# Altium project PCB_15122020_01CA.PrjPcb (part 2 of 7)

## Sheet RS232.SchDoc
size A3
Used 4 times, as channels USB_TO_RS232/RS232_1, USB_TO_RS232/RS232_2, USB_TO_RS232/RS232_3, USB_TO_RS232/RS232_4. Parts and nets are listed once, with the designators drawn on the sheet.
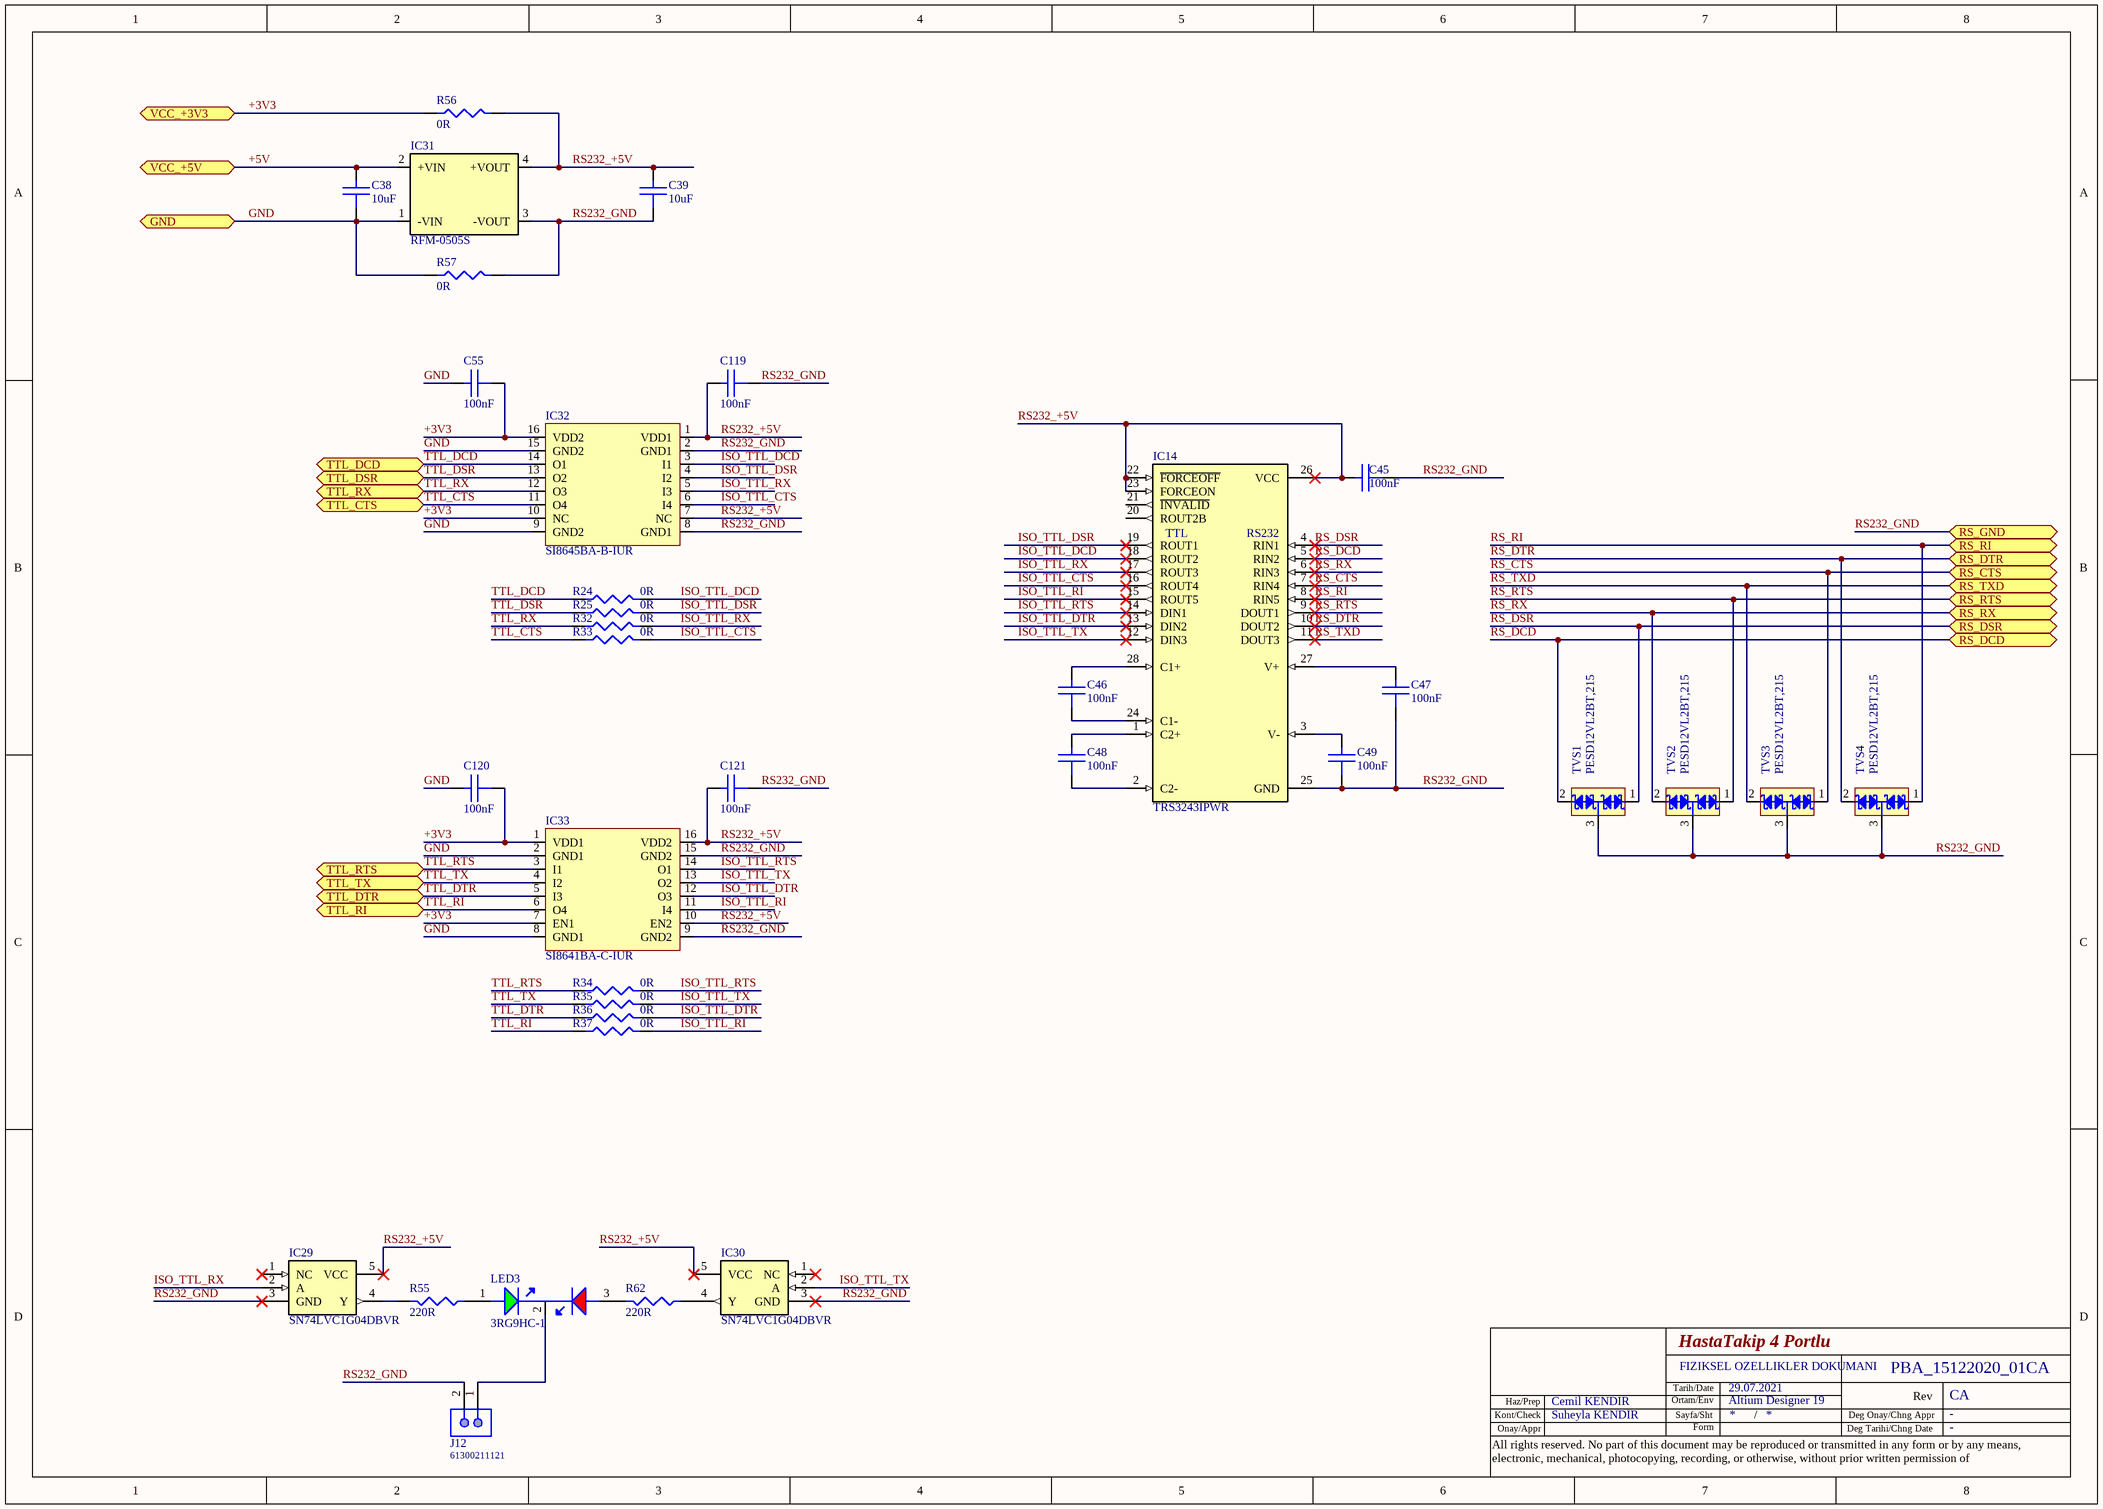
[diagram p2: RS232.SchDoc]

### Parts
C38  10uF  [C0603]
C39  10uF  [C0603]
C45  100nF  [C0603]
C46  100nF  [C0603]
C47  100nF  [C0603]
C48  100nF  [C0603]
C49  100nF  [C0603]
C55  100nF  [C0603]
C119  100nF  [C0603]
C120  100nF  [C0603]
C121  100nF  [C0603]
IC14  TRS3243IPWR  [TSSOP-28]
IC29  SN74LVC1G04DBVR  [SOT-23-5]
IC30  SN74LVC1G04DBVR  [SOT-23-5]
IC31  RFM-0505S  [RFM-0505S]
IC32  SI8645BA-B-IUR  [QSOP16]
IC33  SI8641BA-C-IUR  [QSOP16]
J12  61300211121  [61300211121]
LED3  3RG9HC-1  [3RG9HC-1]
R24  0R  [R0603]
R25  0R  [R0603]
R32  0R  [R0603]
R33  0R  [R0603]
R34  0R  [R0603]
R35  0R  [R0603]
R36  0R  [R0603]
R37  0R  [R0603]
R55  220R  [R0603]
R56  0R  [R0603]
R57  0R  [R0603]
R62  220R  [R0603]
TVS1  PESD12VL2BT,215  [SOT-23]
TVS2  PESD12VL2BT,215  [SOT-23]
TVS3  PESD12VL2BT,215  [SOT-23]
TVS4  PESD12VL2BT,215  [SOT-23]

### Ports
GND (bidir), RS_CTS (bidir), RS_DCD (bidir), RS_DSR (bidir), RS_DTR (bidir), RS_GND (bidir), RS_RI (bidir), RS_RTS (bidir), RS_RX (bidir), RS_TXD (bidir), TTL_CTS (bidir), TTL_DCD (bidir), TTL_DSR (bidir), TTL_DTR (bidir), TTL_RI (bidir), TTL_RTS (bidir), TTL_RX (bidir), TTL_TX (bidir), VCC_+3V3 (bidir), VCC_+5V (bidir)

### Nets
+3V3: C55.2 C120.2 IC32.10(NC) IC32.16(VDD2) IC33.1(VDD1) IC33.7(EN1) R56.1 ; port VCC_+3V3
+5V: C38.1 IC31.2(+VIN) ; port VCC_+5V
GND: C38.2 C55.1 C120.1 IC31.1(-VIN) IC32.9(GND2) IC32.15(GND2) IC33.2(GND1) IC33.8(GND1) R57.1 ; port GND
ISO_TTL_CTS: IC14.16(ROUT4) IC32.6(I4) R33.2
ISO_TTL_DCD: IC14.18(ROUT2) IC32.3(I1) R24.2
ISO_TTL_DSR: IC14.19(ROUT1) IC32.4(I2) R25.2
ISO_TTL_DTR: IC14.13(DIN2) IC33.12(O3) R36.2
ISO_TTL_RI: IC14.15(ROUT5) IC33.11(I4) R37.2
ISO_TTL_RTS: IC14.14(DIN1) IC33.14(O1) R34.2
ISO_TTL_RX: IC14.17(ROUT3) IC29.2(A) IC32.5(I3) R32.2
ISO_TTL_TX: IC14.12(DIN3) IC30.2(A) IC33.13(O2) R35.2
RS232_+5V: C39.1 C45.1 C119.1 C121.1 IC14.22(~{FORCEOFF}) IC14.23(FORCEON) IC14.26(VCC) IC29.5(VCC) IC30.5(VCC) IC31.4(+VOUT) IC32.1(VDD1) IC32.7(NC) IC33.10(EN2) IC33.16(VDD2) R56.2
RS232_GND: C39.2 C45.2 C47.2 C49.2 C119.2 C121.2 IC14.25(GND) IC29.3(GND) IC30.3(GND) IC31.3(-VOUT) IC32.2(GND1) IC32.8(GND1) IC33.9(GND2) IC33.15(GND2) J12.2 R57.2 TVS1.3 TVS2.3 TVS3.3 TVS4.3 ; port RS_GND
RS_CTS: IC14.7(RIN4) TVS3.1 ; port RS_CTS
RS_DCD: IC14.5(RIN2) TVS1.2 ; port RS_DCD
RS_DSR: IC14.4(RIN1) TVS1.1 ; port RS_DSR
RS_DTR: IC14.10(DOUT2) TVS4.2 ; port RS_DTR
RS_RI: IC14.8(RIN5) TVS4.1 ; port RS_RI
RS_RTS: IC14.9(DOUT1) TVS2.1 ; port RS_RTS
RS_RX: IC14.6(RIN3) TVS2.2 ; port RS_RX
RS_TXD: IC14.11(DOUT3) TVS3.2 ; port RS_TXD
TTL_CTS: IC32.11(O4) R33.1 ; port TTL_CTS
TTL_DCD: IC32.14(O1) R24.1 ; port TTL_DCD
TTL_DSR: IC32.13(O2) R25.1 ; port TTL_DSR
TTL_DTR: IC33.5(I3) R36.1 ; port TTL_DTR
TTL_RI: IC33.6(O4) R37.1 ; port TTL_RI
TTL_RTS: IC33.3(I1) R34.1 ; port TTL_RTS
TTL_RX: IC32.12(O3) R32.1 ; port TTL_RX
TTL_TX: IC33.4(I2) R35.1 ; port TTL_TX
NetC46_1: C46.1 IC14.28(C1+)
NetC46_2: C46.2 IC14.24(C1-)
NetC47_1: C47.1 IC14.27(V+)
NetC48_1: C48.1 IC14.1(C2+)
NetC48_2: C48.2 IC14.2(C2-)
NetC49_1: C49.1 IC14.3(V-)
NetIC29_4: IC29.4(Y) R55.2
NetIC30_4: IC30.4(Y) R62.1
NetJ12_1: J12.1 LED3.2
NetLED3_1: LED3.1 R55.1
NetLED3_3: LED3.3 R62.2

Not connected (* = marked no-connect by the designer): IC14 20(ROUT2B) 21(~{INVALID}); IC29 1(NC)*; IC30 1(NC)*

### Channels
USB_TO_RS232/RS232_1: designators end in _RS232_1; ports GND=GND RS_CTS=RS_CTS RS_DCD=RS_DCD RS_DSR=RS_DSR RS_DTR=RS_DTR RS_GND=RS232_GND RS_RI=RS_RI RS_RTS=RS_RTS RS_RX=RS_RX RS_TXD=RS_TXD TTL_CTS=TTL_CTS TTL_DCD=TTL_DCD TTL_DSR=TTL_DSR TTL_DTR=TTL_DTR TTL_RI=TTL_RI TTL_RTS=TTL_RTS TTL_RX=TTL_RX TTL_TX=TTL_TX VCC_+3V3=+3V3 VCC_+5V=+5V
USB_TO_RS232/RS232_2: designators end in _RS232_2; ports GND=GND RS_CTS=RS_CTS RS_DCD=RS_DCD RS_DSR=RS_DSR RS_DTR=RS_DTR RS_GND=RS232_GND RS_RI=RS_RI RS_RTS=RS_RTS RS_RX=RS_RX RS_TXD=RS_TXD TTL_CTS=TTL_CTS TTL_DCD=TTL_DCD TTL_DSR=TTL_DSR TTL_DTR=TTL_DTR TTL_RI=TTL_RI TTL_RTS=TTL_RTS TTL_RX=TTL_RX TTL_TX=TTL_TX VCC_+3V3=+3V3 VCC_+5V=+5V
USB_TO_RS232/RS232_3: designators end in _RS232_3; ports GND=GND RS_CTS=RS_CTS RS_DCD=RS_DCD RS_DSR=RS_DSR RS_DTR=RS_DTR RS_GND=RS232_GND RS_RI=RS_RI RS_RTS=RS_RTS RS_RX=RS_RX RS_TXD=RS_TXD TTL_CTS=TTL_CTS TTL_DCD=TTL_DCD TTL_DSR=TTL_DSR TTL_DTR=TTL_DTR TTL_RI=TTL_RI TTL_RTS=TTL_RTS TTL_RX=TTL_RX TTL_TX=TTL_TX VCC_+3V3=+3V3 VCC_+5V=+5V
USB_TO_RS232/RS232_4: designators end in _RS232_4; ports GND=GND RS_CTS=RS_CTS RS_DCD=RS_DCD RS_DSR=RS_DSR RS_DTR=RS_DTR RS_GND=RS232_GND RS_RI=RS_RI RS_RTS=RS_RTS RS_RX=RS_RX RS_TXD=RS_TXD TTL_CTS=TTL_CTS TTL_DCD=TTL_DCD TTL_DSR=TTL_DSR TTL_DTR=TTL_DTR TTL_RI=TTL_RI TTL_RTS=TTL_RTS TTL_RX=TTL_RX TTL_TX=TTL_TX VCC_+3V3=+3V3 VCC_+5V=+5V

### Notes on the sheet
- Tarih/Date
- Kont/Check
- Onay/Appr
- Haz/Prep
- Ortam/Env
- Sayfa/Sht
- Form
- /
- Deg Tarihi/Chng Date
- Deg Onay/Chng Appr
- Rev
- All rights reserved. No part of this document may be reproduced or transmitted in any form or by any means, electronic, mechanical, photocopying, recording, or otherwise, without prior written permission of
- (in symbol TRS3243IPWR) TTL; RS232

### Library data of the parts
C38 C39 = CC0603MRX5R6BB106: 10uF 10V X5R 20% SMD 0603 85C Paper T/R; Manufacturer: Yageo; Supplier 1: Digi-Key; Supplier Part Number 1: 311-1817-1-ND; Manufacturer Part Number: CC0603MRX5R6BB106; Stock 1: 209492; Pricing 1: 1 = 0,20000, 10 = 0,13700, 50 = 0,08200, 100 = 0,06920, 500 = 0,04736, 1000 = 0,04190 (USD); RoHS: Yes; Mount: Surface Mount; Case/Package: 0603; Case Code (Imperial): 0603; Case Code (Metric): 1608; Weight: 7.1E-05oz; Min Operating Temperature: -55°C; Max Operating Temperature: 85°C; Voltage Rating: 10V; Termination: SMD/SMT; Resistor Type: Ceramic; Dielectric: X5R; Tolerance: 20%; Packaging: Tape and Reel; Capacitance: 10uF; Voltage Rating (DC): 10V; Length: 0.063inch; Width: 0.031inch; Thickness: 0.035inch; Depth: 0.8mm; Lead Free: Lead Free; Halogen Free: Halogen Free; ComponentLink1URL: http://components.arrow.com/part/dataview/0323_03079270?src-supplier=Arrow+Europe; ComponentLink1Description: http://components.arrow.com/part/dataview/0323_03079270?src-supplier=Arrow+Europe; ComponentLink2URL: http://www.mouser.com/ds/2/447/UPY-GPHC_X5R_4V-to-50V_25-1131599.pdf?src-supplier=Mouser; ComponentLink2Description: http://www.mouser.com/ds/2/447/UPY-GPHC_X5R_4V-to-50V_25-1131599.pdf?src-supplier=Mouser; ComponentLink3URL: http://www.yageo.com/documents/recent/UPY-GPHC_X5R_4V-to-50V_25.pdf?src-supplier=Digi-Key; ComponentLink3Description: http://www.yageo.com/documents/recent/UPY-GPHC_X5R_4V-to-50V_25.pdf?src-supplier=Digi-Key; Category: Capasitor
C45-C49 C55 C119-C121 = CC0603KRX7R8BB104: 100nF, 25V, X7R, 10%, 0603; Manufacturer: Yageo; Supplier 1: Digi-Key; Supplier Part Number 1: 311-1341-1-ND; Manufacturer Part Number: CC0603KRX7R8BB104; Stock 1: 10150433; Pricing 1: 1 = 0,10000, 10 = 0,04500, 50 = 0,02480, 100 = 0,02020, 500 = 0,01444, 1000 = 0,01134 (USD); RoHS: Yes; Mount: Surface Mount; Case/Package: 0603; Number of Pins: 2; Case Code (Imperial): 0603; Case Code (Metric): 1608; Min Operating Temperature: -55°C; Max Operating Temperature: 125°C; Capacitance: 100nF; Tolerance: 10%; Voltage Rating: 25V; Packaging: Tape and Reel; Package Quantity: 1; Voltage Rating (DC): 25V; Dielectric: X7R; Termination: SMD/SMT; Resistor Type: Ceramic; Voltage: 25V; Length: 1.6mm; Width: 0.8mm; Height: 0.8mm; Thickness: 0.035inch; Depth: 0.8mm; Radiation Hardening: No; REACH SVHC: Unknown; Lead Free: Lead Free; Halogen Free: Halogen Free; ComponentLink1URL: https://datasheet.ciiva.com/11786/0900766b80c10176-11786120.pdf?src-supplier=RSComponents; ComponentLink1Description: https://datasheet.ciiva.com/11786/0900766b80c10176-11786120.pdf?src-supplier=RSComponents; ComponentLink2URL: https://datasheet.ciiva.com/144/mlccorderingcode-144075.pdf?src-supplier=Digi-Key; ComponentLink2Description: https://datasheet.ciiva.com/144/mlccorderingcode-144075.pdf?src-supplier=Digi-Key; ComponentLink3URL: https://datasheet.ciiva.com/17434/upy-gphc-x7r-6-3v-to-50v-8-17434263.pdf?src-supplier=Avnet+Europe; ComponentLink3Description: https://datasheet.ciiva.com/17434/upy-gphc-x7r-6-3v-to-50v-8-17434263.pdf?src-supplier=Avnet+Europe; ComponentLink4URL: https://datasheet.ciiva.com/26829/getdatasheetpartid-403577-26829431.pdf?src-supplier=Verical; ComponentLink4Description: https://datasheet.ciiva.com/26829/getdatasheetpartid-403577-26829431.pdf?src-supplier=Verical; ComponentLink5URL: https://datasheet.ciiva.com/11587/upy-gphc-x7r-6-3v-to-50v-8-11587208.pdf?src-supplier=Avnet; ComponentLink5Description: https://datasheet.ciiva.com/11587/upy-gphc-x7r-6-3v-to-50v-8-11587208.pdf?src-supplier=Avnet; ComponentLink6URL: https://datasheet.ciiva.com/13389/upy-gphc-x7r-6-3v-to-50v-8-13389352.pdf?src-supplier=Mouser; ComponentLink6Description: https://datasheet.ciiva.com/13389/upy-gphc-x7r-6-3v-to-50v-8-13389352.pdf?src-supplier=Mouser; ComponentLink7URL: https://datasheet.ciiva.com/28450/1489800-28450584.pdf?src-supplier=Element14; ComponentLink7Description: https://datasheet.ciiva.com/28450/1489800-28450584.pdf?src-supplier=Element14; ComponentLink8URL: https://datasheet.ciiva.com/144/mlccorderingcode-144073.pdf?src-supplier=Digi-Key; ComponentLink8Description: https://datasheet.ciiva.com/144/mlccorderingcode-144073.pdf?src-supplier=Digi-Key; ComponentLink9URL: https://datasheet.ciiva.com/144/mlccorderingcode-144074.pdf?src-supplier=Digi-Key; ComponentLink9Description: https://datasheet.ciiva.com/144/mlccorderingcode-144074.pdf?src-supplier=Digi-Key; ComponentLink10URL: https://datasheet.ciiva.com/7978/1489800-7978155.pdf?src-supplier=Element14; ComponentLink10Description: https://datasheet.ciiva.com/7978/1489800-7978155.pdf?src-supplier=Element14; Category: Capasitor
IC14 = TRS3243IPWR: 3-V to 5.5-V Multichannel RS-232 Line Driver/Receiver With +/-15-kV (HBM) ESD Protection 28-TSSOP -40 to 85; Manufacturer: Texas Instruments; Data Rate: 250Kbps; Number of Receivers: 5; Number of Transmitters: 3; Max Supply Voltage: 5.5V; Min Supply Voltage: 3V; Nominal Supply Current: 1mA; Number of Transceivers: 1; Operating Supply Voltage: 5V; Supplier 1: Mouser; Supplier Part Number 1: 595-TRS3243IPWR; Manufacturer Part Number: TRS3243IPWR; Stock 1: 2373; Pricing 1: 1 = 1,72000, 10 = 1,46000, 100 = 1,17000, 250 = 1,03000, 500 = 0,99100, 1000 = 0,78700 (USD); Mount: Surface Mount; Case/Package: TSSOP; Number of Pins: 28; Weight: 0.004145oz; Min Operating Temperature: -40°C; Max Operating Temperature: 85°C; Package Quantity: 1; Packaging: Tape and Reel; Number of Drivers: 3; Logic Function: Receiver; Radiation Hardening: No; Lead Free: Lead Free; ComponentLink1URL: https://datasheet.ciiva.com/26913/getdatasheetpartid-247119-26913223.pdf?src-supplier=Verical; ComponentLink1Description: https://datasheet.ciiva.com/26913/getdatasheetpartid-247119-26913223.pdf?src-supplier=Verical; ComponentLink2URL: https://datasheet.ciiva.com/1705/trs3243-1705475.pdf?src-supplier=Digi-Key; ComponentLink2Description: https://datasheet.ciiva.com/1705/trs3243-1705475.pdf?src-supplier=Digi-Key; ComponentLink3URL: https://datasheet.ciiva.com/1705/trs3243-1705476.pdf?src-supplier=Digi-Key; ComponentLink3Description: https://datasheet.ciiva.com/1705/trs3243-1705476.pdf?src-supplier=Digi-Key; ComponentLink4URL: https://datasheet.ciiva.com/1705/trs3243-1705477.pdf?src-supplier=Digi-Key; ComponentLink4Description: https://datasheet.ciiva.com/1705/trs3243-1705477.pdf?src-supplier=Digi-Key; ComponentLink5URL: https://octopart.com/click/track?ai=10049&ct=datasheets&sig=01ed8e4&at=physicalpart&sid=370&ppid=7097462&hlid=30260159&src-supplier=TI+store; ComponentLink5Description: https://octopart.com/click/track?ai=10049&ct=datasheets&sig=01ed8e4&at=physicalpart&sid=370&ppid=7097462&hlid=30260159&src-supplier=TI+store; ComponentLink6URL: http://datasheet.octopart.com/TRS3243IPWR-Texas-Instruments-datasheet-149751.pdf?src-supplier=TI+store; ComponentLink6Description: http://datasheet.octopart.com/TRS3243IPWR-Texas-Instruments-datasheet-149751.pdf?src-supplier=TI+store; ComponentLink7URL: http://datasheet.octopart.com/TRS3243IPWR-Texas-Instruments-datasheet-10256493.pdf?src-supplier=TI+store; ComponentLink7Description: http://datasheet.octopart.com/TRS3243IPWR-Texas-Instruments-datasheet-10256493.pdf?src-supplier=TI+store; ComponentLink8URL: http://datasheet.octopart.com/TRS3243IPWR-Texas-Instruments-datasheet-41218929.pdf?src-supplier=TI+store; ComponentLink8Description: http://datasheet.octopart.com/TRS3243IPWR-Texas-Instruments-datasheet-41218929.pdf?src-supplier=TI+store; ComponentLink9URL: http://sigma.octopart.com/49249796/technical_drawing/Texas-Instruments-TRS3243IPWR.pdf?src-supplier=TI+store; ComponentLink9Description: http://sigma.octopart.com/49249796/technical_drawing/Texas-Instruments-TRS3243IPWR.pdf?src-supplier=TI+store; Category: Integrated Circuits-Interface - Drivers, Receivers, Transceivers
IC29 IC30 = SN74LVC1G04DBVR: Inverter 1-Element CMOS 5-Pin SOT-23 T/R; Manufacturer: Texas Instruments; Number of Inputs: 1; Propagation Delay: 3.7ns; Output Current: 32mA; Min Supply Voltage: 1.65V; Max Supply Voltage: 5.5V; Logic Function: Inverter,Inverting,Buffer; Quiescent Current: 10uA; High Level Output Current: -32mA; Turn-On Delay Time: 7.5ns; Schmitt Trigger Input: No; Supplier 1: Digi-Key; Manufacturer Part Number: SN74LVC1G04DBVR; Stock 1: 132873; Pricing 1: 1 = 0,30000, 10 = 0,24700, 25 = 0,20720, 100 = 0,13110, 250 = 0,10120, 500 = 0,08624, 1000 = 0,05865 (USD); RoHS: Yes; Mount: Surface Mount; Case/Package: SOT-23; Number of Pins: 5; Weight: 0.000557oz; Contact Plating: Tin,Matte; Min Operating Temperature: -40°C; Max Operating Temperature: 125°C; Packaging: Tape and Reel; Max Output Current: 32mA; Number of Elements: 1; Package Quantity: 1; Number of Circuits: 1; Low Level Output Current: 32mA; Termination: SMD/SMT; Number of Gates: 1; Number of Bits: 1; Length: 3.05mm; Width: 1.75mm; Height: 1.3mm; Radiation Hardening: No; REACH SVHC: No SVHC; Lead Free: Lead Free; RoHS Compliant: Yes; ComponentLink1URL: https://datasheet.ciiva.com/1864/sn74lvc1g04-1864160.pdf?src-supplier=Digi-Key; ComponentLink1Description: https://datasheet.ciiva.com/1864/sn74lvc1g04-1864160.pdf?src-supplier=Digi-Key; ComponentLink2URL: https://datasheet.ciiva.com/7783/1700972-7783424.pdf?src-supplier=Element14; ComponentLink2Description: https://datasheet.ciiva.com/7783/1700972-7783424.pdf?src-supplier=Element14; ComponentLink3URL: https://datasheet.ciiva.com/36526/2014932-36526251.pdf?src-supplier=Jameco; ComponentLink3Description: https://datasheet.ciiva.com/36526/2014932-36526251.pdf?src-supplier=Jameco; ComponentLink4URL: https://datasheet.ciiva.com/14290/sn74lvc1g04-14290295.pdf?src-supplier=Avnet; ComponentLink4Description: https://datasheet.ciiva.com/14290/sn74lvc1g04-14290295.pdf?src-supplier=Avnet; ComponentLink5URL: https://datasheet.ciiva.com/1864/sn74lvc1g04-1864158.pdf?src-supplier=Digi-Key; ComponentLink5Description: https://datasheet.ciiva.com/1864/sn74lvc1g04-1864158.pdf?src-supplier=Digi-Key; Category: Integrated Circuits (ICs); Supplier Part Number 1: 296-11599-1-ND
IC31 = RFM-0505S: RECOM POWER - RFM-0505S - Isolated Board Mount DC/DC Converter, ITE & General, 1 Output, 1 W, 5 V, 200 mA; Max Output Voltage: 5V; Supplier 1: Digi-Key; Manufacturer: Recom; Manufacturer Part Number: RFM-0505S; Stock 1: 13682; Pricing 1: 1 = 1,40000, 5 = 1,38000, 10 = 1,36000, 25 = 1,32000, 50 = 1,28000, 100 = 1,24000, 250 = 1,20000, 500 = 1,12000 (USD); RoHS: No; Weight: 1.4g; Length: 11.5mm; Height: 10mm; Width: 6mm; ComponentLink1URL: http://www.farnell.com/datasheets/2787866.pdf?src-supplier=Farnell; ComponentLink1Description: http://www.farnell.com/datasheets/2787866.pdf?src-supplier=Farnell; ComponentLink2URL: https://www.recom-power.com/pdf/Econoline/RFM.pdf?src-supplier=Digi-Key; ComponentLink2Description: https://www.recom-power.com/pdf/Econoline/RFM.pdf?src-supplier=Digi-Key; ComponentLink3URL: http://www.farnell.com/datasheets/2787866.pdf?src-supplier=Newark; ComponentLink3Description: http://www.farnell.com/datasheets/2787866.pdf?src-supplier=Newark; Supplier Part Number 1: 945-3159-ND; Category: Power Supplies - Board Mount DC-DC Converters
IC32 = SI8645BA-B-IUR: Digital Isolator CMOS 4-CH 150Mbps Automotive 16-Pin QSOP T/R; Manufacturer: Silicon Labs; Number of Channels: 4; Propagation Delay: 13ns; Channel Type: Unidirectional; Isolated Power: No; Pulse Width Distortion (PWD): 4.5ns; Supplier 1: Digi-Key; Manufacturer Part Number: SI8645BA-B-IUR; Stock 1: 4650; Pricing 1: 1 = 1,64000, 25 = 1,57480, 100 = 1,55400 (USD); RoHS: Yes; Case/Package: QSOP; Number of Pins: 16; Weight: 0.002931oz; Min Operating Temperature: -40°C; Max Operating Temperature: 125°C; Package Quantity: 2500; Packaging: Tape and Reel; Data Rate: 150Mbps; Type: General Purpose; Series: Si8645BA; RoHS Compliant: Yes; ComponentLink1URL: https://datasheet.ciiva.com/15272/si864x-15272845.pdf?src-supplier=Arrow+Europe; ComponentLink1Description: https://datasheet.ciiva.com/15272/si864x-15272845.pdf?src-supplier=Arrow+Europe; ComponentLink2URL: https://datasheet.ciiva.com/8124/si864x-8124729.pdf?src-supplier=Avnet; ComponentLink2Description: https://datasheet.ciiva.com/8124/si864x-8124729.pdf?src-supplier=Avnet; Supplier Part Number 1: SI8645BA-B-IURCT-ND; Category: Isolators
IC33 = SI8641BA-C-IUR: General Purpose tal Isolator 1000Vrms 4 Channel 150Mbps 35kV/µs CMTI 16-SSOP (0.154 , 3.90mm Width); Manufacturer: Silicon Labs; Number of Channels: 4; Channel Type: Unidirectional; Propagation Delay: 13ns; Isolated Power: No; Pulse Width Distortion (PWD): 4.5ns; Supplier 1: Digi-Key; Manufacturer Part Number: SI8641BA-C-IUR; Stock 1: 611; Pricing 1: 1 = 1,64000, 25 = 1,57480, 100 = 1,55400 (USD); RoHS: Yes; Case/Package: SSOP; Number of Pins: 16; Min Operating Temperature: -40°C; Max Operating Temperature: 125°C; Type: General Purpose; Packaging: Tape and Reel; Data Rate: 150Mbps; ComponentLink1URL: https://datasheet.ciiva.com/48508/si864x-48508591.pdf?src-supplier=Avnet; ComponentLink1Description: https://datasheet.ciiva.com/48508/si864x-48508591.pdf?src-supplier=Avnet; Supplier Part Number 1: 336-4939-1-ND; Category: Isolators
J12 = 61300211121: WR-PHD Pin Header, THT, pitch 2.54mm, Single Row, Vertical, 2pin; Manufacturer: Wurth Electronics; Pin Number: 2; Gender: Male; Rated Current: 3A; Working Voltage: 250VAC; Withstanding Voltage: 500VAC; Contact Resistance: 20mOhm; Voltage Rating: 250V; Connector Type: Male Pin; ComponentLink1Description: Manufacturer; ComponentLink1URL: http://www.we-online.de; ComponentLink2Description: Datasheet; ComponentLink2URL: https://katalog.we-online.de/em/datasheet/6130xx11121.pdf; Part Number: 61300211121; Published Date: June 2019; Publisher: Wurth Elektronik; Pitch: 2.54mm; Operating Temperature: -40 to +105degC; Mounting Technology: THT; Packaging: Bag; Row Number: Single; Orientation: Vertical; Supplier 1: Digi-Key; Manufacturer Part Number: 61300211121; Stock 1: 150487; Pricing 1: 1 = 0,13000, 10 = 0,10600, 25 = 0,08800, 50 = 0,07400, 100 = 0,06700, 1000 = 0,06100 (USD); RoHS: Yes; Mount: Through Hole; Contact Plating: Gold; Housing Material: PBT; Contact Material: Copper Alloy,Copper; Color: Black; Min Operating Temperature: -40°C; Max Operating Temperature: 125°C; Number of Rows: 1; Contact Gender: Male; Current Rating: 3A; Number of Positions: 2; Termination: Through Hole; Number of Contacts: 2; Contact Mating Length: 0.236inch; REACH SVHC: Unknown; Lead Free: Lead Free; ComponentLink3URL: https://datasheet.ciiva.com/13619/6130xx11121-48870-13619345.pdf?src-supplier=Mouser; ComponentLink3Description: https://datasheet.ciiva.com/13619/6130xx11121-48870-13619345.pdf?src-supplier=Mouser; Category: Connectors, Interconnects Rectangular Connectors; Supplier Part Number 1: 732-5315-ND
LED3 = 3RG9HC-1: LED 3MM RED, GREEN R:30mcd, G:60mcd 40°; Manufacturer: STRONG BASE; Category: Led; Supplier 1: Özdisan; Supplier Part Number 1: 3RG9HC-1
R24 R25 R32-R37 R56 R57 = RC0603FR-070RL: 0R ,%1 ,1/10 W ,0603; Manufacturer: Yageo; Resistance: 0mR; Power Rating: 100mW; Tolerance: 1%; Voltage Rating: 50V; Temperature Coefficient: 200ppm/°C; Current Rating: 1A; Working Voltage: 75V; Supplier 1: Digi-Key; Supplier Part Number 1: 311-0.0HRCT-ND; Manufacturer Part Number: RC0603FR-070RL; Stock 1: 513794; Pricing 1: 1 = 0,10000, 10 = 0,01800, 25 = 0,01280, 50 = 0,00980, 100 = 0,00730, 250 = 0,00552, 500 = 0,00442, 1000 = 0,00326 (USD); RoHS: Yes; Case/Package: 0603; Number of Pins: 2; Case Code (Metric): 1608; Case Code (Imperial): 0603; Contact Plating: Tin,Matte; Min Operating Temperature: -55°C; Max Operating Temperature: 155°C; Packaging: Tape and Reel; Package Quantity: 5000; Resistor Type: Thick Film; Number of Terminations: 2; Termination: SMD/SMT; Max Power Dissipation: 100mW; Voltage Rating (DC): 50V; Features: Moisture Resistant; Length: 1.6mm; Width: 0.031inch; Height: 0.45mm; Depth: 0.8mm; Radiation Hardening: No; REACH SVHC: No SVHC; Military Standard: Not; Lead Free: Lead Free; ComponentLink1URL: https://datasheet.ciiva.com/11808/0900766b80f96399-11808172.pdf?src-supplier=RSComponents; ComponentLink1Description: https://datasheet.ciiva.com/11808/0900766b80f96399-11808172.pdf?src-supplier=RSComponents; ComponentLink2URL: https://datasheet.ciiva.com/5558/rc0603-272842-5558341.pdf?src-supplier=Mouser; ComponentLink2Description: https://datasheet.ciiva.com/5558/rc0603-272842-5558341.pdf?src-supplier=Mouser; ComponentLink3URL: https://datasheet.ciiva.com/46382/443971-46382072.pdf?src-supplier=Element14; ComponentLink3Description: https://datasheet.ciiva.com/46382/443971-46382072.pdf?src-supplier=Element14; ComponentLink4URL: https://datasheet.ciiva.com/29721/pyu-r-int-thick-7-29721178.pdf?src-supplier=Digi-Key; ComponentLink4Description: https://datasheet.ciiva.com/29721/pyu-r-int-thick-7-29721178.pdf?src-supplier=Digi-Key; ComponentLink5URL: https://datasheet.ciiva.com/5684/443971-5684699.pdf?src-supplier=Farnell; ComponentLink5Description: https://datasheet.ciiva.com/5684/443971-5684699.pdf?src-supplier=Farnell; ComponentLink6URL: https://datasheet.ciiva.com/7983/443971-7983627.pdf?src-supplier=Element14; ComponentLink6Description: https://datasheet.ciiva.com/7983/443971-7983627.pdf?src-supplier=Element14; ComponentLink7URL: https://datasheet.ciiva.com/29721/pyu-rc0603-51-rohs-l-4-29721179.pdf?src-supplier=Digi-Key; ComponentLink7Description: https://datasheet.ciiva.com/29721/pyu-rc0603-51-rohs-l-4-29721179.pdf?src-supplier=Digi-Key; ComponentLink8URL: https://datasheet.ciiva.com/22643/1868787-22643388.pdf?src-supplier=Element14; ComponentLink8Description: https://datasheet.ciiva.com/22643/1868787-22643388.pdf?src-supplier=Element14; Category: Resistor
R55 R62 = RC0603FR-07220RL: 220 R, %1, 1/10W, 0603; Manufacturer: Yageo; Tolerance: 1%; Voltage Rating (DC): 50V; Temperature Coefficient: 100ppm/°C; Power Rating: 100mW; Supplier 1: Digi-Key; Supplier Part Number 1: 311-220HRCT-ND; Manufacturer Part Number: RC0603FR-07220RL; Stock 1: 3174401; Pricing 1: 1 = 0,10000, 10 = 0,02100, 100 = 0,00840, 1000 = 0,00379, 2500 = 0,00329 (USD); RoHS: Yes; Case/Package: 0603; Number of Pins: 2; Case Code (Imperial): 0603; Case Code (Metric): 1608; Min Operating Temperature: -55°C; Max Operating Temperature: 155°C; Resistance: 220R; Packaging: Tape and Reel; Resistor Type: Thick Film; Voltage Rating: 50V; Package Quantity: 1; Termination: SMD/SMT; Number of Terminations: 2; Max Power Dissipation: 100mW; Features: Moisture Resistant; Length: 1.6mm; Width: 0.031inch; Height: 0.022inch; Depth: 0.8mm; REACH SVHC: No SVHC; Lead Free: Lead Free; Military Standard: Not; ComponentLink1URL: https://datasheet.ciiva.com/2453/pyu-r-int-thick-7-2453973.pdf?src-supplier=Digi-Key; ComponentLink1Description: https://datasheet.ciiva.com/2453/pyu-r-int-thick-7-2453973.pdf?src-supplier=Digi-Key; ComponentLink2URL: https://datasheet.ciiva.com/2453/pyu-r-int-thick-7-2453974.pdf?src-supplier=Digi-Key; ComponentLink2Description: https://datasheet.ciiva.com/2453/pyu-r-int-thick-7-2453974.pdf?src-supplier=Digi-Key; ComponentLink3URL: https://datasheet.ciiva.com/2453/pyu-r-int-thick-7-2453975.pdf?src-supplier=Digi-Key; ComponentLink3Description: https://datasheet.ciiva.com/2453/pyu-r-int-thick-7-2453975.pdf?src-supplier=Digi-Key; ComponentLink4URL: https://datasheet.ciiva.com/7746/1738695-7746300.pdf?src-supplier=Element14; ComponentLink4Description: https://datasheet.ciiva.com/7746/1738695-7746300.pdf?src-supplier=Element14; ComponentLink5URL: https://datasheet.ciiva.com/7746/1738695-7746301.pdf?src-supplier=Element14; ComponentLink5Description: https://datasheet.ciiva.com/7746/1738695-7746301.pdf?src-supplier=Element14; Category: Resistor
TVS1-TVS4 = PESD12VL2BT,215: TVS DIODE 12V 37V SOT23; Manufacturer: Nexperia; Supplier 1: Digi-Key; Manufacturer Part Number: PESD12VL2BT,215; Stock 1: 13763; Pricing 1: 1 = 0,44000, 10 = 0,35700, 100 = 0,24320, 500 = 0,18240, 1000 = 0,13680 (USD); RoHS: Yes; RoHS Compliant: Yes; ComponentLink1URL: http://www.farnell.com/datasheets/698115.pdf?src-supplier=Farnell; ComponentLink1Description: http://www.farnell.com/datasheets/698115.pdf?src-supplier=Farnell; ComponentLink2URL: https://assets.nexperia.com/documents/data-sheet/PESDXL2BT_SER.pdf?src-supplier=Digi-Key; ComponentLink2Description: https://assets.nexperia.com/documents/data-sheet/PESDXL2BT_SER.pdf?src-supplier=Digi-Key; ComponentLink3URL: http://www.farnell.com/datasheets/698115.pdf?src-supplier=Newark; ComponentLink3Description: http://www.farnell.com/datasheets/698115.pdf?src-supplier=Newark; Supplier Part Number 1: 1727-3809-1-ND; Category: Circuit Protection - TVS - Diodes

## Sheet USB_Hub.SchDoc
size A3
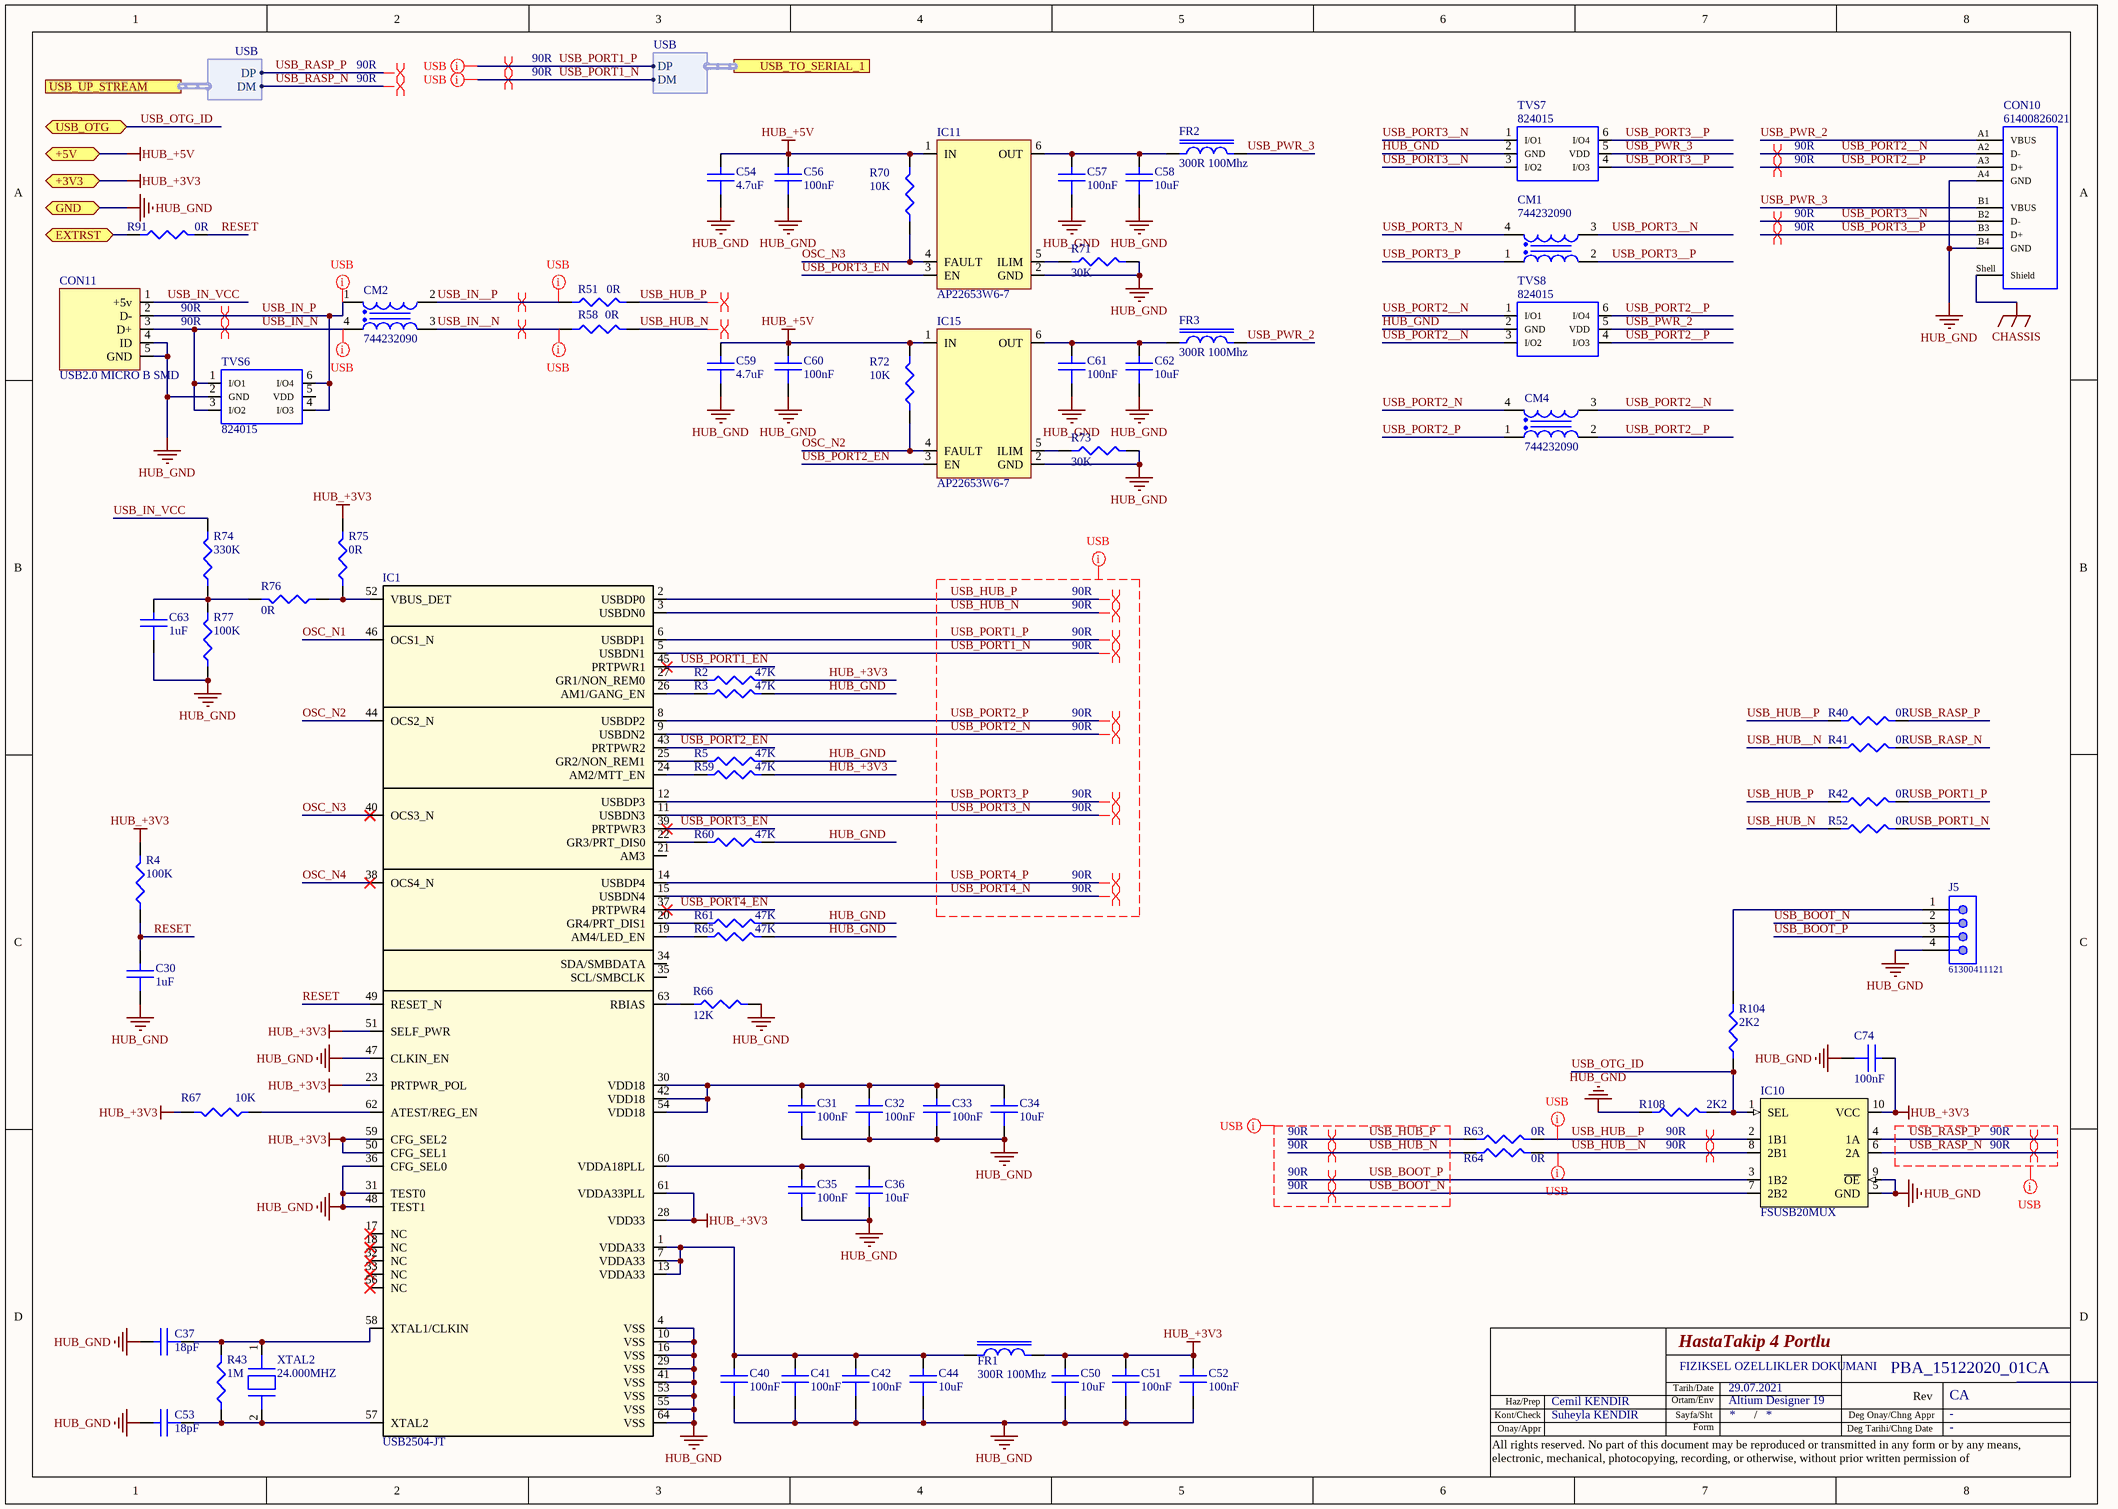
[diagram p3: USB_Hub.SchDoc]

### Parts
C30  1uF  [C0603]
C31  100nF  [C0603]
C32  100nF  [C0603]
C33  100nF  [C0603]
C34  10uF  [C0603]
C35  100nF  [C0603]
C36  10uF  [C0603]
C37  18pF  [C0603]
C40  100nF  [C0603]
C41  100nF  [C0603]
C42  100nF  [C0603]
C44  10uF  [C0603]
C50  10uF  [C0603]
C51  100nF  [C0603]
C52  100nF  [C0603]
C53  18pF  [C0603]
C54  4.7uF  [C0603]
C56  100nF  [C0603]
C57  100nF  [C0603]
C58  10uF  [C0603]
C59  4.7uF  [C0603]
C60  100nF  [C0603]
C61  100nF  [C0603]
C62  10uF  [C0603]
C63  1uF  [C0603]
C74  100nF  [C0603]
CM1  744232090  [WE-CNSW_1206]
CM2  744232090  [WE-CNSW_1206]
CM4  744232090  [WE-CNSW_1206]
CON10  61400826021  [61400826021]
CON11  USB2.0 MICRO B SMD  [USB CON B FEMALE]
FR1  300R 100Mhz  [WE-CBF_0603_High Current]
FR2  300R 100Mhz  [WE-CBF_0603_High Current]
FR3  300R 100Mhz  [WE-CBF_0603_High Current]
IC1  USB2504-JT  [TQFP64]
IC10  FSUSB20MUX  [MSOP-10N]
IC11  AP22653W6-7  [SOT23-6]
IC15  AP22653W6-7  [SOT23-6]
J5  61300411121  [61300411121]
R2  47K  [R0603]
R3  47K  [R0603]
R4  100K  [R0603]
R5  47K  [R0603]
R40  0R  [R0402]
R41  0R  [R0402]
R42  0R  [R0402]
R43  1M  [R0603]
R51  0R  [R0402]
R52  0R  [R0402]
R58  0R  [R0402]
R59  47K  [R0603]
R60  47K  [R0603]
R61  47K  [R0603]
R63  0R  [R0402]
R64  0R  [R0402]
R65  47K  [R0603]
R66  12K  [R0603]
R67  10K  [R0603]
R70  10K  [R0603]
R71  30K  [R0603]
R72  10K  [R0603]
R73  30K  [R0603]
R74  330K  [R0603]
R75  0R  [R0603]
R76  0R  [R0603]
R77  100K  [R0603]
R91  0R  [R0603]
R104  2K2  [R0603]
R108  2K2  [R0603]
TVS6  824015  [SOT-23-6]
TVS7  824015  [SOT-23-6]
TVS8  824015  [SOT-23-6]
XTAL2  24.000MHZ  [CrystalSMD]

### Ports
+3V3 (bidir), +5V (bidir), EXTRST (bidir), GND (bidir), USB_OTG (bidir), USB_TO_SERIAL_1 (harness USB), USB_UP_STREAM (harness USB)

### Harnesses
USB: DP, DM

### Nets
CHASSIS: CON10.Shell(Shield)
HUB_+3V3: C50.1 C51.1 C52.1 C74.1 FR1.2 IC1.23(PRTPWR_POL) IC1.28(VDD33) IC1.50(CFG_SEL1) IC1.51(SELF_PWR) IC1.59(CFG_SEL2) IC1.61(VDDA33PLL) IC10.10(VCC) R2.2 R4.2 R59.2 R67.2 R75.2 ; port +3V3  [project net +3V3]
HUB_+5V: C54.1 C56.1 C59.1 C60.1 IC11.1(IN) IC15.1(IN) R70.2 R72.2 ; port +5V  [project net +5V]
HUB_GND: C30.2 C31.2 C32.2 C33.2 C34.2 C35.2 C36.2 C37.1 C40.2 C41.2 C42.2 C44.2 C50.2 C51.2 C52.2 C53.1 C54.2 C56.2 C57.2 C58.2 C59.2 C60.2 C61.2 C62.2 C63.2 C74.2 CON10.A4(GND) CON10.B4(GND) CON11.4(ID) CON11.5(GND) IC1.4(VSS) IC1.10(VSS) IC1.16(VSS) IC1.29(VSS) IC1.31(TEST0) IC1.36(CFG_SEL0) IC1.41(VSS) IC1.47(CLKIN_EN) IC1.48(TEST1) IC1.53(VSS) IC1.55(VSS) IC1.64(VSS) IC10.5(GND) IC10.9(~{OE}) IC11.2(GND) IC15.2(GND) J5.4 R3.2 R5.2 R60.2 R61.2 R65.2 R66.2 R71.2 R73.2 R77.1 R108.1 TVS6.2(GND) TVS7.2(GND) TVS8.2(GND) ; port GND  [project net GND]
nEXTRST: R91.1 ; port EXTRST
OSC_N1: IC1.46(OCS1_N)
OSC_N2: IC1.44(OCS2_N) IC15.4(FAULT) R72.1
OSC_N3: IC1.40(OCS3_N) IC11.4(FAULT) R70.1
OSC_N4: IC1.38(OCS4_N)
RESET: C30.1 IC1.49(RESET_N) R4.1 R91.2
USB_BOOT_N: IC10.7(2B2) J5.2
USB_BOOT_P: IC10.3(1B2) J5.3
USB_HUB__N: IC10.8(2B1) R41.1 R64.2
USB_HUB__P: IC10.2(1B1) R40.1 R63.2
USB_HUB_N: IC1.3(USBDN0) R52.1 R58.2 R64.1
USB_HUB_P: IC1.2(USBDP0) R42.1 R51.2 R63.1
USB_IN__N: CM2.3 R58.1
USB_IN__P: CM2.2 R51.1
USB_IN_N: CM2.4 CON11.3(D+) TVS6.1(I/O1) TVS6.3(I/O2)
USB_IN_P: CM2.1 CON11.2(D-) TVS6.4(I/O3) TVS6.6(I/O4)
USB_IN_VCC: CON11.1(+5v) R74.2
USB_OTG_ID: IC10.1(SEL) R104.1 R108.2 ; port USB_OTG
USB_PORT1_EN: IC1.45(PRTPWR1)
USB_PORT1_N: IC1.5(USBDN1) R52.2 ; port USB_TO_SERIAL_1.DM  [project net USB_1_N]
USB_PORT1_P: IC1.6(USBDP1) R42.2 ; port USB_TO_SERIAL_1.DP  [project net USB_1_P]
USB_PORT2__N: CM4.3 CON10.A2(D-) TVS8.1(I/O1) TVS8.3(I/O2)
USB_PORT2__P: CM4.2 CON10.A3(D+) TVS8.4(I/O3) TVS8.6(I/O4)
USB_PORT2_EN: IC1.43(PRTPWR2) IC15.3(EN)
USB_PORT2_N: CM4.4 IC1.9(USBDN2)
USB_PORT2_P: CM4.1 IC1.8(USBDP2)
USB_PORT3__N: CM1.3 CON10.B2(D-) TVS7.1(I/O1) TVS7.3(I/O2)
USB_PORT3__P: CM1.2 CON10.B3(D+) TVS7.4(I/O3) TVS7.6(I/O4)
USB_PORT3_EN: IC1.39(PRTPWR3) IC11.3(EN)
USB_PORT3_N: CM1.4 IC1.11(USBDN3)
USB_PORT3_P: CM1.1 IC1.12(USBDP3)
USB_PORT4_EN: IC1.37(PRTPWR4)
USB_PORT4_N: IC1.15(USBDN4)
USB_PORT4_P: IC1.14(USBDP4)
USB_PWR_2: CON10.A1(VBUS) FR3.2 TVS8.5(VDD)
USB_PWR_3: CON10.B1(VBUS) FR2.2 TVS7.5(VDD)
USB_RASP_N: IC10.6(2A) R41.2 ; port USB_UP_STREAM.DM  [project net USB_N]
USB_RASP_P: IC10.4(1A) R40.2 ; port USB_UP_STREAM.DP  [project net USB_P]
NetC31_1: C31.1 C32.1 C33.1 C34.1 IC1.30(VDD18) IC1.42(VDD18) IC1.54(VDD18)
NetC35_1: C35.1 C36.1 IC1.60(VDDA18PLL)
NetC37_2: C37.2 IC1.58(XTAL1/CLKIN) R43.2 XTAL2.1
NetC40_1: C40.1 C41.1 C42.1 C44.1 FR1.1 IC1.1(VDDA33) IC1.7(VDDA33) IC1.13(VDDA33)
NetC53_2: C53.2 IC1.57(XTAL2) R43.1 XTAL2.2
NetC57_1: C57.1 C58.1 FR2.1 IC11.6(OUT)
NetC61_1: C61.1 C62.1 FR3.1 IC15.6(OUT)
NetC63_1: C63.1 R74.1 R76.2 R77.2
NetIC1_19: IC1.19(AM4/LED_EN) R65.1
NetIC1_20: IC1.20(GR4/PRT_DIS1) R61.1
NetIC1_22: IC1.22(GR3/PRT_DIS0) R60.1
NetIC1_24: IC1.24(AM2/MTT_EN) R59.1
NetIC1_25: IC1.25(GR2/NON_REM1) R5.1
NetIC1_26: IC1.26(AM1/GANG_EN) R3.1
NetIC1_27: IC1.27(GR1/NON_REM0) R2.1
NetIC1_52: IC1.52(VBUS_DET) R75.1 R76.1
NetIC1_62: IC1.62(ATEST/REG_EN) R67.1
NetIC1_63: IC1.63(RBIAS) R66.1
NetIC11_5: IC11.5(ILIM) R71.1
NetIC15_5: IC15.5(ILIM) R73.1
NetJ5_1: J5.1 R104.2

Not connected (* = marked no-connect by the designer): IC1 17(NC)* 18(NC)* 21(AM3) 32(NC)* 33(NC)* 34(SDA/SMBDATA) 35(SCL/SMBCLK) 56(NC)*; TVS6 5(VDD)

### Layout directives
differential pair; differential pair class 90R: USB_1_N, USB_1_P, USB_BOOT_N, USB_BOOT_P, USB_HUB__N, USB_HUB__P, USB_HUB_N, USB_HUB_P, USB_IN__N, USB_IN__P, USB_IN_N, USB_IN_P, USB_N, USB_P, USB_PORT2__N, USB_PORT2__P, USB_PORT2_N, USB_PORT2_P, USB_PORT3__N, USB_PORT3__P, USB_PORT3_N, USB_PORT3_P, USB_PORT4_N, USB_PORT4_P
net class USB: USB_1_N, USB_1_P, USB_BOOT_N, USB_BOOT_P, USB_HUB__N, USB_HUB__P, USB_HUB_N, USB_HUB_P, USB_IN__N, USB_IN__P, USB_IN_N, USB_IN_P, USB_PORT1_N, USB_PORT1_P, USB_PORT2_N, USB_PORT2_P, USB_PORT3_N, USB_PORT3_P, USB_PORT4_N, USB_PORT4_P, USB_RASP_N, USB_RASP_P

### Notes on the sheet
- Tarih/Date
- Kont/Check
- Onay/Appr
- Haz/Prep
- Ortam/Env
- Sayfa/Sht
- Form
- /
- Deg Tarihi/Chng Date
- Deg Onay/Chng Appr
- Rev
- All rights reserved. No part of this document may be reproduced or transmitted in any form or by any means, electronic, mechanical, photocopying, recording, or otherwise, without prior written permission of